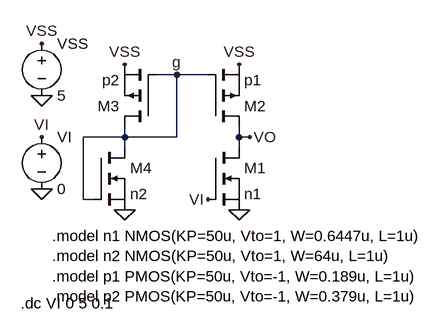
[diagram p0: schematic 19-16-11-a-1.asc]
19-16-11-a-1.asc, the LTspice schematic file:
Version 4
SHEET 1 880 680
WIRE 240 112 208 112
WIRE 288 112 240 112
WIRE 160 208 160 192
WIRE 160 208 96 208
WIRE 240 208 240 112
WIRE 240 208 160 208
WIRE 336 208 336 192
WIRE 352 208 336 208
WIRE 160 224 160 208
WIRE 336 224 336 208
WIRE 96 304 96 208
WIRE 112 304 96 304
FLAG 160 96 VSS
FLAG 336 96 VSS
FLAG 352 208 VO
FLAG 160 320 0
FLAG 336 320 0
FLAG 288 304 VI
FLAG 240 112 g
FLAG 32 144 0
FLAG 32 64 VSS
FLAG 32 288 0
FLAG 32 208 VI
SYMBOL pmos 208 192 R180
SYMATTR InstName M3
SYMATTR Value p2
SYMBOL pmos 288 192 M180
SYMATTR InstName M2
SYMATTR Value p1
SYMBOL nmos 112 224 R0
SYMATTR InstName M4
SYMATTR Value n2
SYMBOL nmos 288 224 R0
SYMATTR InstName M1
SYMATTR Value n1
SYMBOL voltage 32 48 R0
WINDOW 123 0 0 Left 0
WINDOW 39 0 0 Left 0
SYMATTR InstName VSS
SYMATTR Value 5
SYMBOL voltage 32 192 R0
WINDOW 123 0 0 Left 0
WINDOW 39 0 0 Left 0
SYMATTR InstName VI
SYMATTR Value 0
TEXT 48 360 Left 2 !.model n1 NMOS(KP=50u, Vto=1, W=0.6447u, L=1u)\n.model n2 NMOS(KP=50u, Vto=1, W=64u, L=1u)\n.model p1 PMOS(KP=50u, Vto=-1, W=0.189u, L=1u)\n.model p2 PMOS(KP=50u, Vto=-1, W=0.379u, L=1u)
TEXT 0 464 Left 2 !.dc VI 0 5 0.1

The netlist it stands for:
* 19-16-11-a-1.asc
M3 g g VSS VSS p2
M2 VO g VSS VSS p1
M4 g g 0 0 n2
M1 VO VI 0 0 n1
VSS VSS 0 5
VI VI 0 0
.model NMOS NMOS
.model PMOS PMOS
.lib standard.mos
.model n1 NMOS(KP=50u, Vto=1, W=0.6447u, L=1u)
.model n2 NMOS(KP=50u, Vto=1, W=64u, L=1u)
.model p1 PMOS(KP=50u, Vto=-1, W=0.189u, L=1u)
.model p2 PMOS(KP=50u, Vto=-1, W=0.379u, L=1u)
.dc VI 0 5 0.1
.backanno
.end